# Altium project PCB_Project_4.PrjPcb
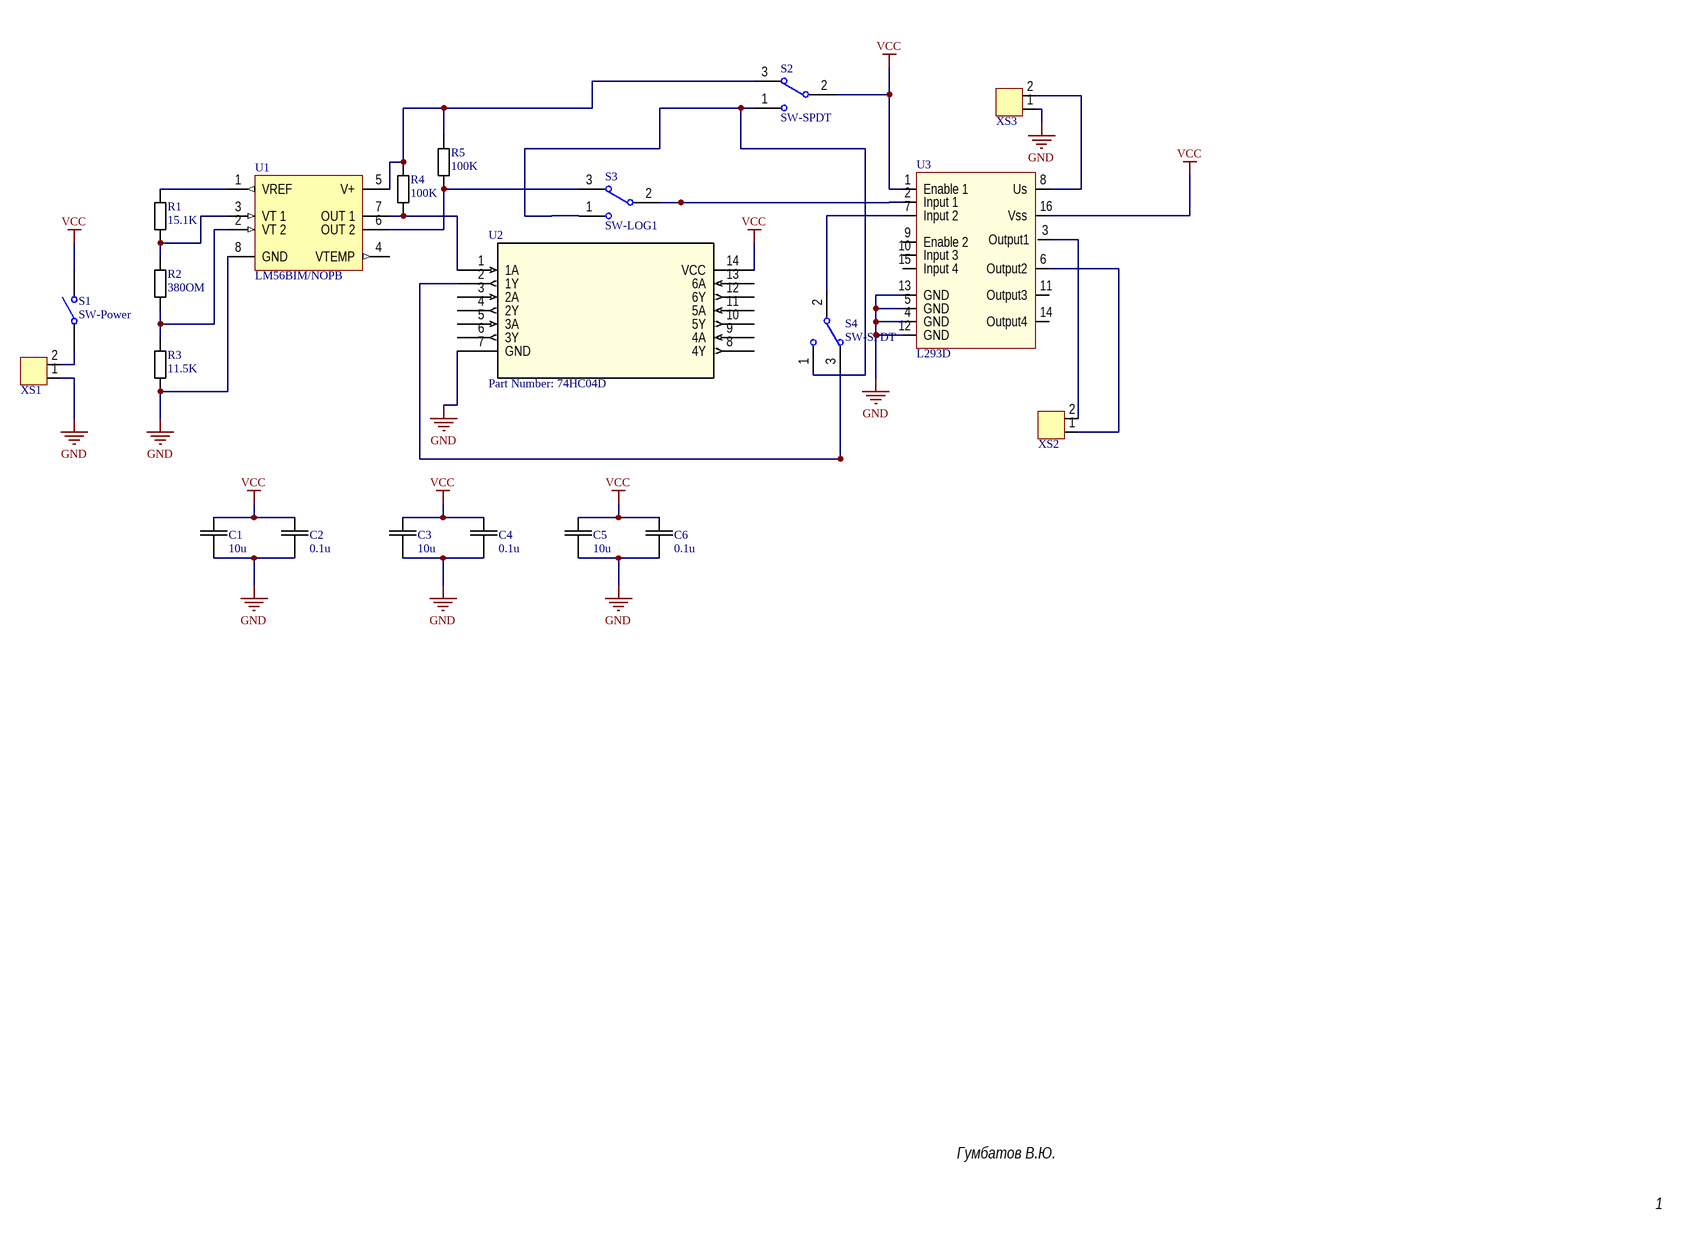
[diagram p0: Sheet1.SchDoc]
1 sheet, 21 parts. Net scope: global (net labels, ports and power ports of the same name join across sheets).
Board file: PCB2.PcbDoc

## Sheet Sheet1.SchDoc
size 420 x 297 mm; Date: 18.06.2019; Scale: 1:1

### Parts
C1  Val: 10u  [CAP0805]  (hidden comment: CAP_0805)
C2  Val: 0.1u  [CAP0805]  (hidden comment: CAP_0805)
C3  Val: 10u  [CAP0805]  (hidden comment: CAP_0805)
C4  Val: 0.1u  [CAP0805]  (hidden comment: CAP_0805)
C5  Val: 10u  [CAP0805]  (hidden comment: CAP_0805)
C6  Val: 0.1u  [CAP0805]  (hidden comment: CAP_0805)
R1  Val: 15.1K  [RES-0.125]  (hidden comment: RES-0.125)
R2  Val: 380OM  [RES-0.125]  (hidden comment: RES-0.125)
R3  Val: 11.5K  [RES-0.125]  (hidden comment: RES-0.125)
R4  Val: 100K  [RES-0.125]  (hidden comment: RES-0.125)
R5  Val: 100K  [RES-0.125]  (hidden comment: RES-0.125)
S1  SW-Power  [SPST-2]
S2  SW-SPDT  [TL36WW15050]
S3  SW-LOG1  [TL36WW15050]
S4  SW-SPDT  [TL36WW15050]
U1  LM56BIM/NOPB  [M08A_M]
U2  Part Number: 74HC04D  [SOT108-1]
U3  L293D  [DIP16]
XS1  DG340-3.81-02P  [DG340-3.81-02P]  (value not drawn)
XS2  DG340-3.81-02P  [DG340-3.81-02P]  (value not drawn)
XS3  DG340-3.81-02P  [DG340-3.81-02P]  (value not drawn)

### Nets
GND: C1.2 C2.2 C3.2 C4.2 C5.2 C6.2 R3.1 U1.8(GND) U2.7(GND) U3.4(GND) U3.5(GND) U3.12(GND) U3.13(GND) XS1.1 XS3.1
VCC: C1.1 C2.1 C3.1 C4.1 C5.1 C6.1 S1.2(NO) S2.2 U2.14(VCC) U3.1(Enable_1) U3.16(Vss)
NetR1_1: R1.1 R2.2 U1.3(VT_1)
NetR1_2: R1.2 U1.1(VREF)
NetR2_1: R2.1 R3.2 U1.2(VT_2)
NetR4_1: R4.1 U1.7(OUT_1) U2.1(1A)
NetR4_2: R4.2 R5.2 S2.3 U1.5(V+)
NetR5_1: R5.1 S3.3 U1.6(OUT_2)
NetS1_1: S1.1(COMMON) XS1.2
NetS2_1: S2.1 S3.1 S4.1
NetS3_2: S3.2 U3.2(Input_1)
NetS4_2: S4.2 U3.7(Input_2)
NetS4_3: S4.3 U2.2(1Y)
NetU3_3: U3.3(Output1) XS2.2
NetU3_6: U3.6(Output2) XS2.1
NetU3_8: U3.8(Us) XS3.2

Not connected (* = marked no-connect by the designer): U1 4(VTEMP); U2 3(2A) 4(2Y) 5(3A) 6(3Y) 8(4Y) 9(4A) 10(5Y) 11(5A) 12(6Y) 13(6A); U3 9(Enable_2) 10(Input_3) 11(Output3) 14(Output4) 15(Input_4)

### Notes on the sheet
- Гумбатов В.Ю.
- 1
- Перв. примен.
- Справ. №
- Подп. и дата
- Инв. № дубл.
- Взам. инв. №
- Разраб.
- Изм.
- Лист
- № докум.
- Подп.
- Дата
- Лит.
- Масса
- Масштаб
- Пров.
- Т.контр.
- Листов
- Инв. № подл.
- Утв.
- Н.контр.
- 2.106-A3
- Копировал
- Формат А3

### Library data of the parts
C1-C6 = CAP_0805: Ceramic capacitor, 0805
S1 = SW-SPST: Single-Pole, Single-Throw Switch; Published: 24-Mar-1999; LatestRevisionDate: 17-Jul-2002; LatestRevisionNote: Re-released for DXP Platform.; PackageReference: SPST-2; Publisher: Altium Limited; PackageDescription: Switch; 2 Leads
S2-S4 = SW-SPDT: SPDT Subminiature Toggle Switch, Right Angle Mounting, Vertical Actuation; Published: 24-Mar-1999; LatestRevisionDate: 17-Dec-2003; LatestRevisionNote: Schematic revised, PCB Footprint replaced.; DatasheetVersion: 05-Dec-2000; PackageReference: TL36WW15050; Publisher: Altium Limited; PackageDescription: Switch; 4 Leads; ComponentLink1Description: Manufacturer Link; ComponentLink1URL: http://www.apem.com
U1 = LM56BIM/NOPB: Dual Output Low Power Thermostat, 8-pin Narrow SOIC, Pb-Free; Manufacturer: National Semiconductor; CompType: OtherParts; PowerWise: Y; PackageTopMarking: NSZXTT*LM56*BIM; ComponentLink1Description: LM56 Datasheet; ComponentLink2Description: LM56 Web Page; DatasheetVersion: Aug-2009; PackageReference: M08A; ComponentLink3URL: http://www.national.com/packaging/folders/m08a.html; ComponentLink3Description: M08A Package Page; ComponentLink1URL: http://www.national.com/ds/LM/LM56.pdf; PinCount: 8; Code_JEDEC: MS-012-AA; RevisionNote: Component URLs added; Code_IPC: SOIC127P600-8; PackageVersion: revM, May-2009; PackageDescription: SOIC Narrow, 4.9 x 3.9 x 1.45mm, 8 Lead, 1.27mm Pitch; ComponentLink2URL: http://www.national.com/pf/LM/LM56.html; RoHS: Y; PartNumber: LM56BIM/NOPB
U2 = 74HC04D: No Description Available; Vendor: Nexperia; Manufacturer_Part_Number: 74HC04D; Copyright: Copyright (C) 2016 Accelerated Designs. All rights reserved; RefDes: RefDes; Type: DEV; Value: Value